# EAGLE design NodeBoard (EAGLE 8.4.0)
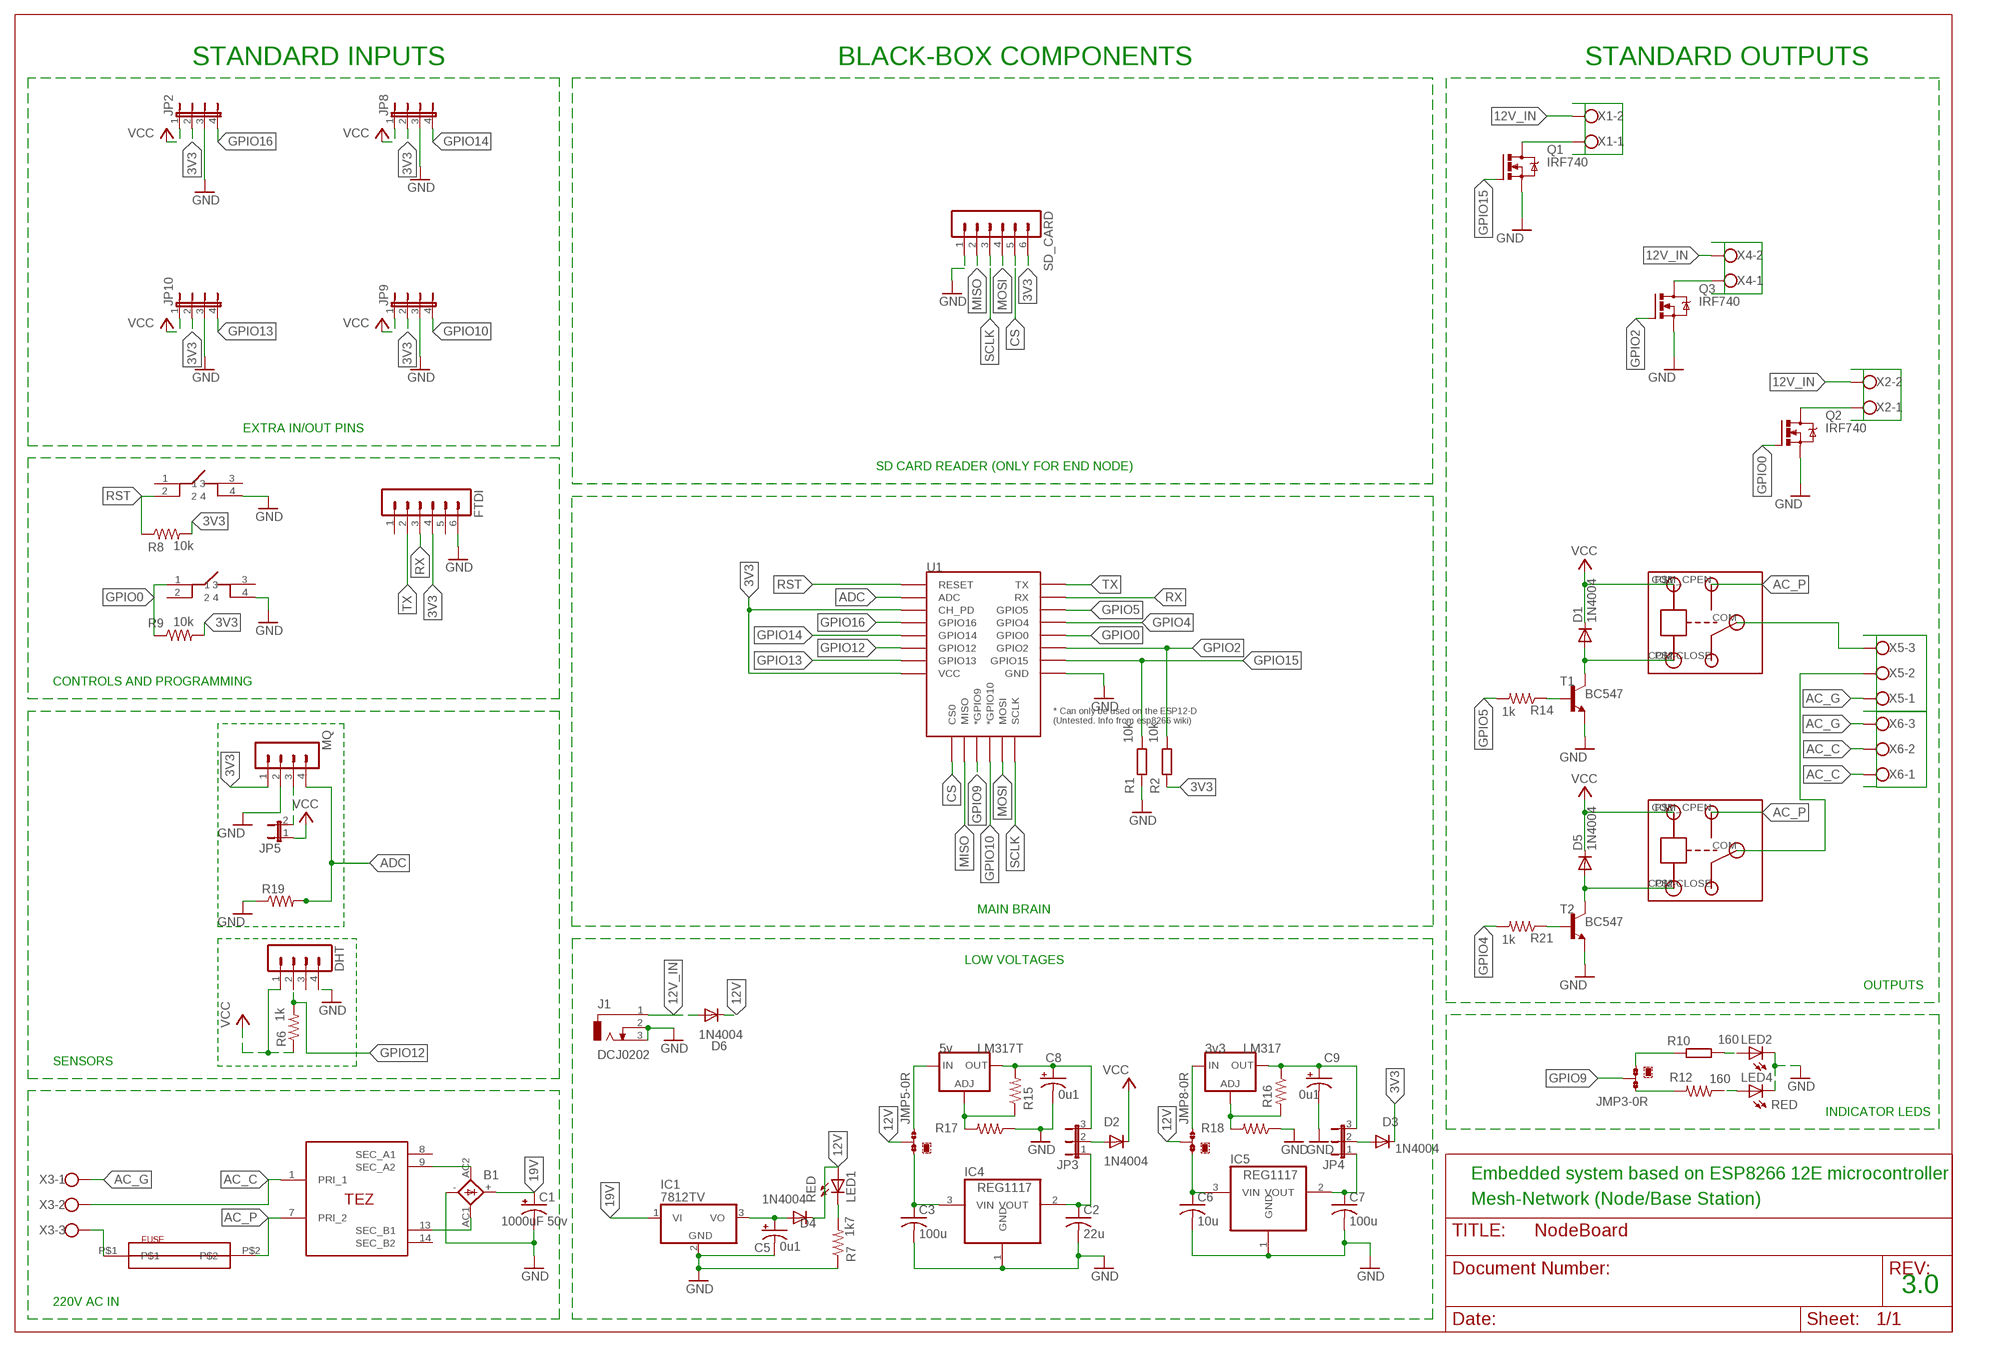
[diagram p0: schematic, sheet 1]

## Parts
B1  KBL  [KBL]
C1  1000uF 50v  CPOL-USE5-13  [E5-13]
C2  22u  C-USC0805  [C0805]
C3  100u  C-USC0805  [C0805]
C5  0u1  CPOL-USE2,5-6E  [E2,5-6E]
C6  10u  C-USC0805  [C0805]
C7  100u  C-USC0805  [C0805]
C8  0u1  CPOL-USE2,5-6E  [E2,5-6E]
C9  0u1  CPOL-USE2,5-6E  [E2,5-6E]
D1  1N4004  [DO41-10]
D2  1N4004  [DO41-10]
D3  1N4004  [DO41-10]
D4  1N4004  [DO41-10]
D5  1N4004  [DO41-10]
D6  1N4004  [DO41-10]
DHT  MA04-1  [MA04-1]
FTDI  MA06-1  [MA06-1]
IC1  7812TV  [TO220V]
IC4  REG1117  [SOT223]
IC5  REG1117  [SOT223]
J1  DCJ0202  [DCJ0202]
JMP3  0R-JUMPA  [A0R-JMP]
JMP5  0R-JUMPA  [A0R-JMP]
JMP8  0R-JUMPA  [A0R-JMP]
JP2  JP4E  [JP4]
JP3  JP2E  [JP2]
JP4  JP2E  [JP2]
JP5  JP1E  [JP1]
JP8  JP4E  [JP4]
JP9  JP4E  [JP4]
JP10  JP4E  [JP4]
LED1  RED  LED5MM  [LED5MM]
LED2  LEDCHIPLED_1206  [CHIPLED_1206]
LED4  RED  LED5MM  [LED5MM]
LM317  3v3  LM317TS  [317TS]
LM317T  5v  LM317TS  [317TS]
MQ  MA04-1  [MA04-1]
Q1  IRF740  [TO220BV]
Q2  IRF740  [TO220BV]
Q3  IRF740  [TO220BV]
R1  10k  R-EU_R0603  [R0603]
R2  10k  R-EU_R0603  [R0603]
R6  1k  R-US_0204/7  [0204/7]
R7  1k7  R-US_0204/7  [0204/7]
R8  10k  R-US_0204/7  [0204/7]
R9  10k  R-US_0204/7  [0204/7]
R10  160  R-EU_R0603  [R0603]
R12  160  R-US_0204/7  [0204/7]
R14  1k  R-US_0204/7  [0204/7]
R15  15k  R-US_0204/7  [0204/7]
R16  1k7  R-US_0204/7  [0204/7]
R17  28k  R-US_0204/7  [0204/7]
R18  1k7  R-US_0204/7  [0204/7]
R19  R-US_0204/7  [0204/7]
R21  1k  R-US_0204/7  [0204/7]
SD_CARD  MA06-1  [MA06-1]
T1  BC547  [TO92]
T2  BC547  [TO92]
U1  ESP12ESMD  [ESP12E-SMD]
U$1  RELAY  [RELAY]
U$2  TEZ_16THROUGH_HOLE  [TEZ_16]
U$3  FUSE_24X11THROUGH_HOLE  [FUSE_24X11]
U$4  RELAY  [RELAY]
U$5  TACT_SWITCHTHROUGH_HOLE  [TACT_SWITCH_TH]
U$6  TACT_SWITCHTHROUGH_HOLE  [TACT_SWITCH_TH]
X1  W237-102  [W237-102]
X2  W237-102  [W237-102]
X3  W237-103  [W237-103]
X4  W237-102  [W237-102]
X5  W237-103  [W237-103]
X6  W237-103  [W237-103]

## Nets
3V3 [3v3]: D3.C FTDI.4 JP2.2 JP8.2 JP9.2 JP10.2 MQ.1 R2.1 R8.2 R9.2 SD_CARD.6 U1.CH_PD U1.VCC
12V [12v]: D4.C D6.C JMP5.2 JMP8.2 LED1.A
12V_IN [12v]: D6.A J1.1 X1.2 X2.2 X4.2
19V [19v]: B1.+ C1.+ IC1.1(VI)
AC_C [220v]: U$2.1(PRI_1) X3.2 X6.1 X6.2
AC_G [220v]: X3.1 X5.1 X6.3
AC_P [220v]: U$1.COM_CPEN(COM-OPEN) U$2.7(PRI_2) U$3.P$2 U$4.COM_CPEN(COM-OPEN)
ADC: MQ.4 R19.2 U1.ADC
CS: SD_CARD.5 U1.CS0
GND: B1.- C1.- C2.2 C3.2 C5.- C6.2 C7.2 C8.- C9.- DHT.4 FTDI.6 IC1.2(GND) IC4.1(GND) IC5.1(GND) J1.2 J1.3 JP2.3 JP8.3 JP9.3 JP10.3 LED2.C LED4.K(C) MQ.2 Q1.S Q2.S Q3.S R1.1 R7.1 R17.1 R18.1 R19.1 SD_CARD.1 T1.1(E) T2.1(E) U1.GND U$5.4 U$6.4
GPIO0: Q2.G R9.1 U1.GPIO0 U$6.1
GPIO2: Q3.G R2.2 U1.GPIO2
GPIO4: R21.2 U1.GPIO4
GPIO5: R14.2 U1.GPIO5
GPIO9: JMP3.2 U1.GPIO9(*GPIO9)
GPIO10: JP9.4 U1.GPIO10(*GPIO10)
GPIO12: DHT.2 R6.2 U1.GPIO12
GPIO13: JP10.4 U1.GPIO13
GPIO14: JP8.4 U1.GPIO14
GPIO15: Q1.G R1.2 U1.GPIO15
GPIO16: JP2.4 U1.GPIO16
MISO: SD_CARD.2 U1.MISO
MOSI: SD_CARD.4 U1.MOSI
N$2 [19v]: B1.AC2(AC1) U$2.9(SEC_A2)
N$4: LED1.K(C) R7.2
N$5 [19v]: B1.AC1(AC2) U$2.13(SEC_B1)
N$8 [220v]: U$1.COM X5.3
N$9: JP5.2 MQ.3
N$18: Q1.D X1.1
N$22: Q3.D X4.1
N$31: LED2.A R10.2
N$33: LED4.A R12.1
N$36: JMP3.1 R12.2
N$37: JMP3.3 R10.1
N$41: R14.1 T1.2(B)
N$42: D1.A T1.3(C) U$1.P$2(GND)
N$44: R21.1 T2.2(B)
N$45 [5v]: C8.+ JP3.3 LM317T.2(OUT) R15.2
N$46: LM317T.1(ADJ) R15.1 R17.2
N$47 [3v3]: C9.+ JP4.3 LM317.2(OUT) R16.1
N$48: LM317.1(ADJ) R16.2 R18.2
N$49 [12v]: JMP5.3 LM317T.3(IN)
N$50 [12v]: JMP8.3 LM317.3(IN)
N$51 [5v]: D2.A JP3.2
N$52 [3v3]: D3.A JP4.2
N$53 [12v]: C5.+ D4.A IC1.3(VO)
N$54 [5v]: C2.1 IC4.2(VOUT) JP3.1
N$55 [12v]: C6.1 IC5.3(VIN) JMP8.1
N$56 [12v]: C3.1 IC4.3(VIN) JMP5.1
N$57: Q2.D X2.1
N$58 [3v3]: C7.1 IC5.2(VOUT) JP4.1
N$60: D5.A T2.3(C) U$4.P$2(GND)
N$62 [220v]: U$3.P$1 X3.3
N$63 [220v]: U$4.COM X5.2
RST: R8.1 U1.RESET U$5.2
RX: FTDI.3 U1.RXD0(RX)
SCLK: SD_CARD.3 U1.SCLK
TX: FTDI.2 U1.TXD0(TX)
VCC [5v]: D1.C D2.C D5.C DHT.1 JP2.1 JP5.1 JP8.1 JP9.1 JP10.1 R6.1 U$1.P$1(IN) U$4.P$1(IN)
Unconnected: DHT.3 FTDI.1 FTDI.5 U$1.COM-CLOSE U$2.8(SEC_A1) U$2.14(SEC_B2) U$4.COM-CLOSE U$5.1 U$5.3 U$6.2 U$6.3

## Notes on the sheet
- STANDARD INPUTS | BLACK-BOX COMPONENTS | STANDARD OUTPUTS
- EXTRA IN/OUT PINS
- SD CARD READER (ONLY FOR END NODE)
- CONTROLS AND PROGRAMMING
- MAIN BRAIN
- LOW VOLTAGES
- OUTPUTS
- SENSORS
- INDICATOR LEDS
- Embedded system based on ESP8266 12E microcontroller
- Mesh-Network (Node/Base Station)
- 3.0
- 220V AC IN

## Library data of the parts
B1 = rectifier:KBL: DIOTEC RECTIFIER
C1 = adafruit:CPOL-US: POLARIZED CAPACITOR, American symbol
C2 C3 C6 C7 = adafruit:C-US: CAPACITOR, American symbol
C5 C8 C9 = resistor:CPOL-US: POLARIZED CAPACITOR, American symbol
D1-D6 = adafruit:1N4004: DIODE General purpose 1N400x type rectifier (With bigger pads) http://www.ladyada.net/library/pcb/eaglelibrary.html
DHT MQ = con-lstb:MA04-1: PIN HEADER; OC_FARNELL: unknown; OC_NEWARK: unknown
FTDI SD_CARD = con-lstb:MA06-1: PIN HEADER; OC_FARNELL: unknown; OC_NEWARK: unknown
IC1 = linear:78*: Positive VOLTAGE REGULATOR Source: http://cache.national.com/ds/LM/LM78L05.pdf http://www.fairchildsemi.com/ds/LM/LM7805.pdf
IC4 IC5 = burr-brown:REG1117: 800mA and 1A Low Dropout (LDO) Positive Regulator 1.8V, 2.5V, 2.85V, 3.3V, 5V, and Adj; MPN: REG1117; OC_FARNELL: 1097566; OC_NEWARK: 14P6981
J1 = con-jack:DCJ0202: DC POWER JACK Source: DCJ0202.pdf; OC_FARNELL: unknown; OC_NEWARK: unknown
JMP3 JMP5 JMP8 = jump-0r-smd:0R-JUMP: SMD 0R 0805 Jumper
JP2 JP8-JP10 = jumper:JP4E: JUMPER
JP3 JP4 = jumper:JP2E: JUMPER
JP5 = jumper:JP1E: JUMPER
LED1 LED4 = led:LED: LED
LED2 = adafruit:LED: LED
LM317 LM317T = v-reg:LM317TS: VOLTAGE REGULATOR
Q1-Q3 = transistor-power:IRF740: N-CHANNEL MOS FET
R1 R2 R10 = resistor:R-EU_: RESISTOR, European symbol
R6-R9 R12 R14-R19 R21 = rcl:R-US_: RESISTOR, American symbol
T1 T2 = transistor:BC547: NPN TRANSISTOR
U1 = esp8266modules:ESP12E: ESP12E Module
U$1 U$4 = relay:RELAY
U$2 = tez_16_transformer:TEZ_16
U$3 = fuse_24x11:FUSE_24X11
U$5 U$6 = tact_switch_th:TACT_SWITCH
X1 X2 X4 = con-wago-500:W237-102: WAGO SCREW CLAMP; MPN: 237-102; OC_FARNELL: unknown; OC_NEWARK: 70K9898
X3 X5 X6 = con-wago-500:W237-103: WAGO SCREW CLAMP; MPN: 237-103; OC_FARNELL: unknown; OC_NEWARK: 18M7116

## Net classes
0 default: width 0.5 mm, clearance 0.45 mm
1 220v: width 2.2 mm, clearance 2.8 mm
2 12v: width 0.5 mm, clearance 0.45 mm
3 5v: width 0.5 mm, clearance 0.45 mm
4 3v3: width 0.5 mm, clearance 0.45 mm
5 19v: width 1 mm, clearance 0.45 mm

## Board
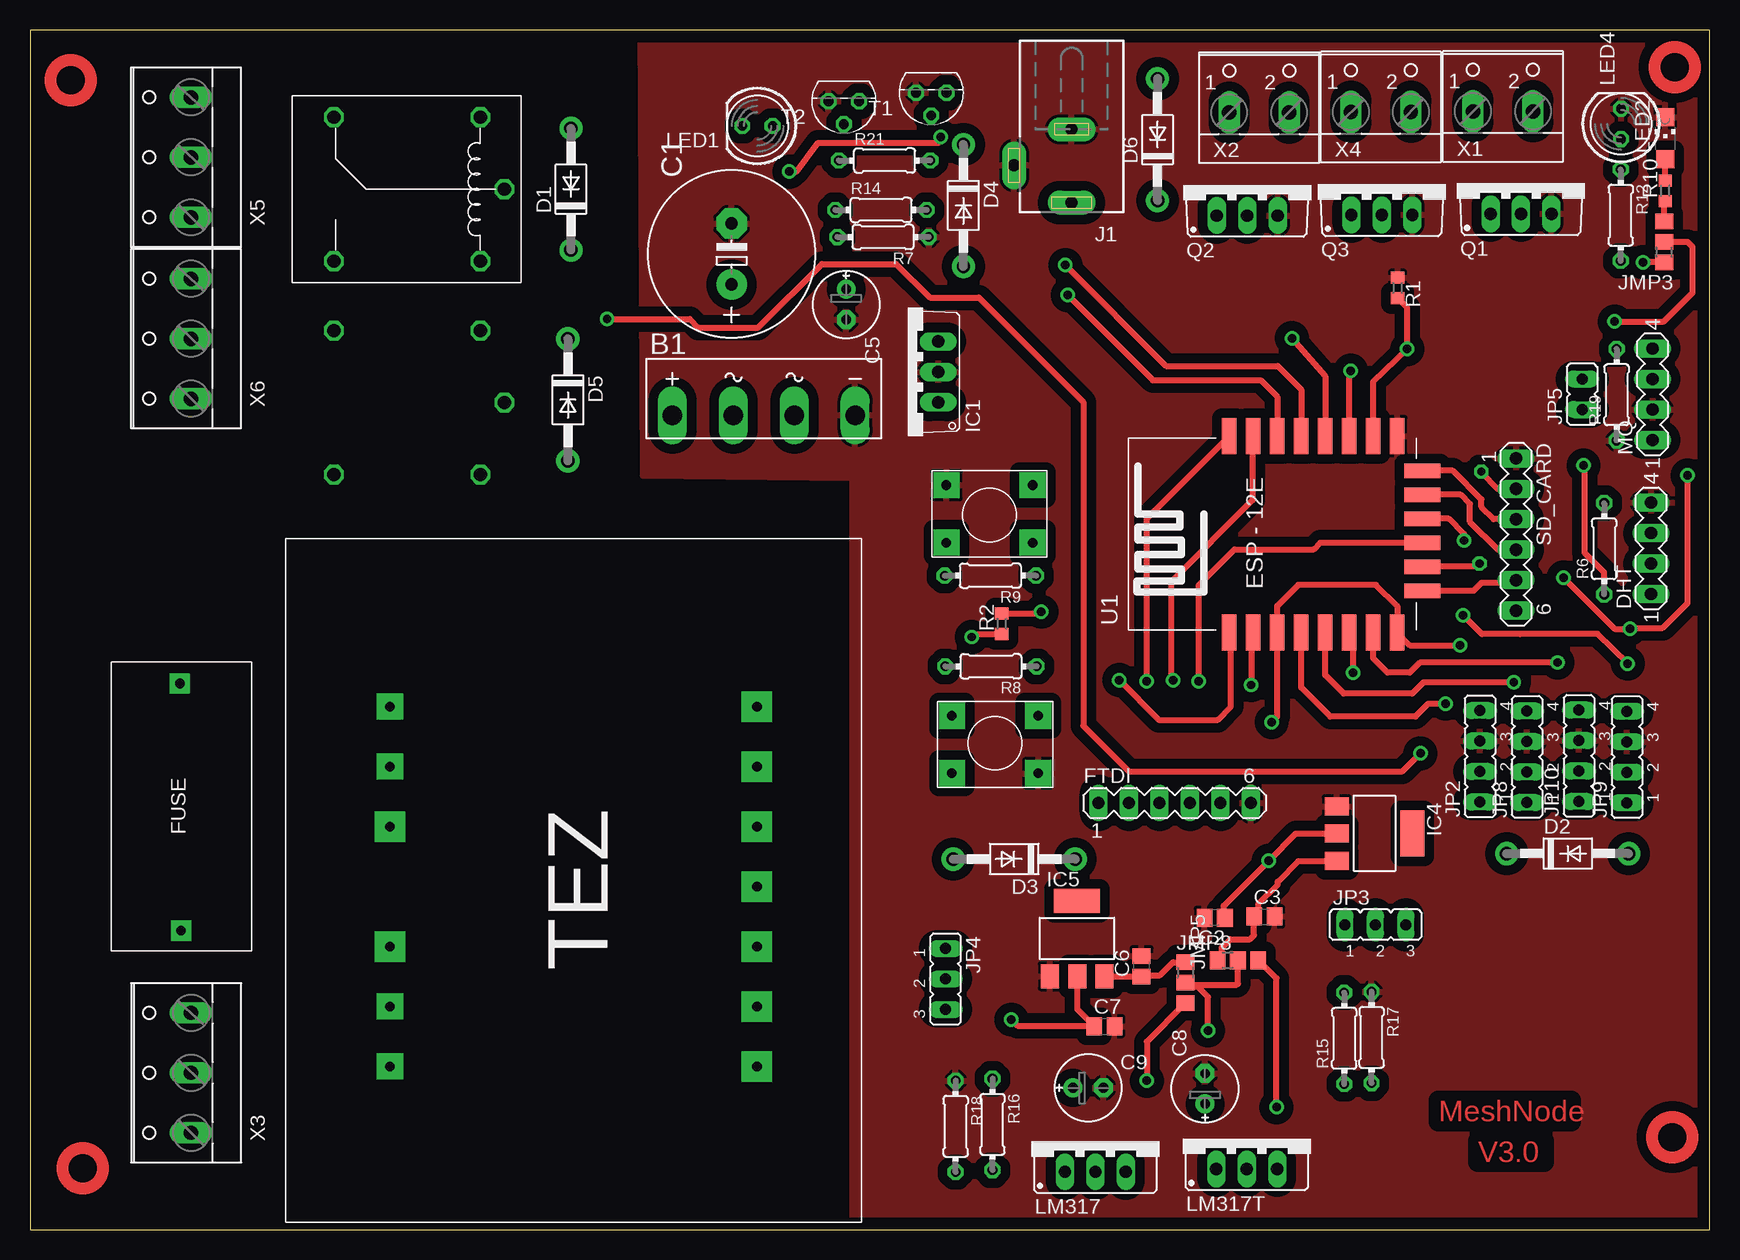
[diagram p1: board, top side]
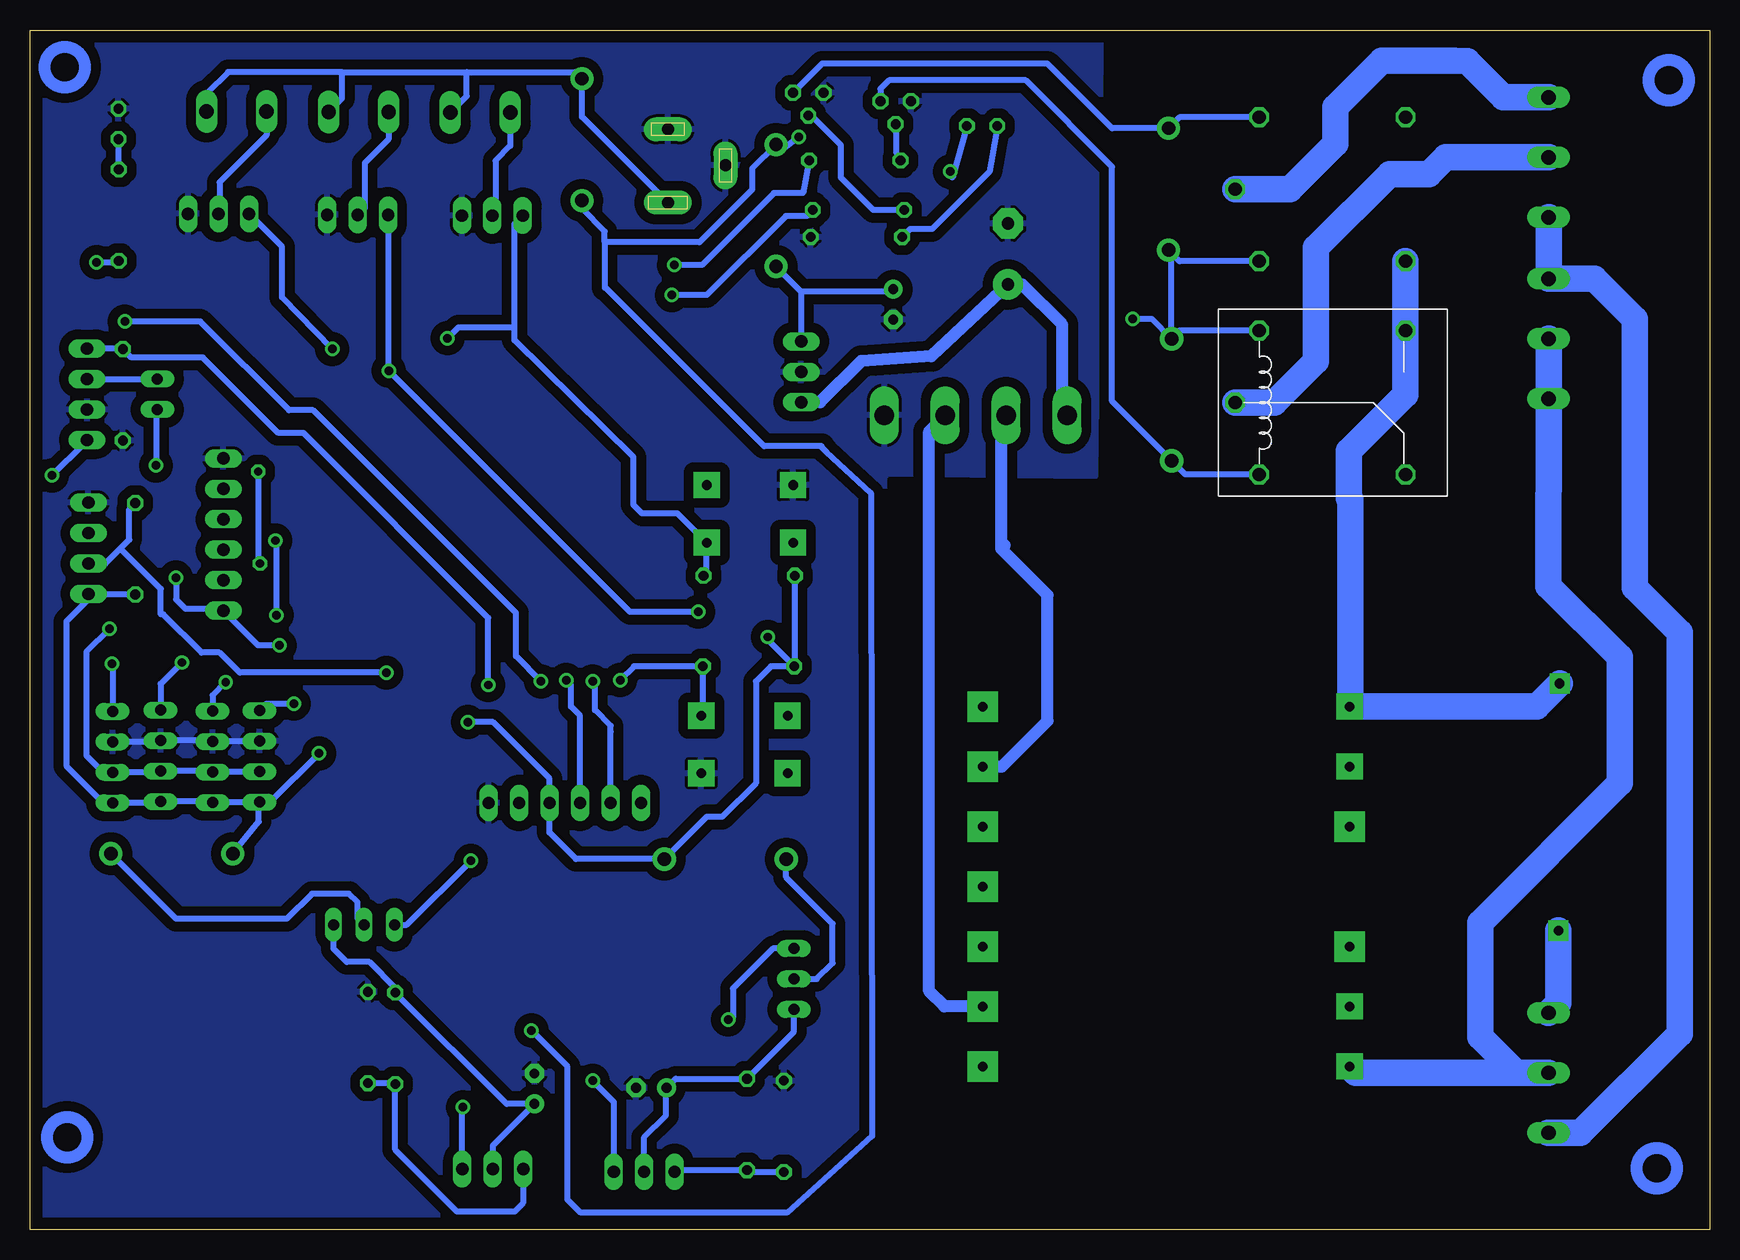
[diagram p2: board, bottom side, seen from below]

Size 140 x 100 mm. Coordinates in mm from the lower left corner, seen from the top.
Outline: 0,0 140,0 140,100 0,100 0,0
Copper layers (1*16): Top 0.035mm / dielectric 1.5mm / Bottom 0.035mm
Design rules "default": minimum track width 6mil, minimum drill 0.35mm, track to track 6mil, track to pad 6mil, pad to pad 6mil, via to via 6mil, smd to smd 6mil, copper to edge 40mil, drill to drill 6mil, minimum pad ring 10mil, minimum via ring 8mil, stop-mask expansion 4mil, vias tented up to drill 0mil, thermal gap 10mil

### Footprints (pad centres in the part's own frame; a part is rotated, then mirrored left to right if it is on the bottom)
KBL = drill 1.6 long: + -7.62,-1.27; - 7.62,-1.27; AC1 2.54,-1.27; AC2 -2.54,-1.27
E5-13 = drill 1.016 pad 2.54: + -2.54,0 | drill 1.016 pad 2.54 octagon: - 2.54,0
C0805 = smd 1.3 x 1.5: 1 -0.85,0; 2 0.85,0
E2,5-6E = drill 0.813 pad 1.575: + -1.27,0 | drill 0.813 pad 1.575 octagon: - 1.27,0
DO41-10 = drill 1.118 pad 1.93: A 5.08,0; C -5.08,0
MA04-1 = drill 1.016 long: 1 -3.81,0; 2 -1.27,0; 3 1.27,0; 4 3.81,0
MA06-1 = drill 1.016 long: 1 -6.35,0; 2 -3.81,0; 3 -1.27,0; 4 1.27,0; 5 3.81,0; 6 6.35,0
TO220V = drill 1.016 long: 1 -2.54,-2.54; 2 0,-2.54; 3 2.54,-2.54
SOT223 = smd 1.499 x 2.007: 1 -2.261,-3.15; 2 0.025,-3.15; 3 2.311,-3.15 | smd 3.81 x 2.007: 4 0,3.15
DCJ0202 = drill 1 pad 2 long: 1 0,3.1; 2 4.8,0; 3 0,-3
A0R-JMP = smd 1.5 x 1.3: 1 0,1.7; 2 0,0; 3 0,-1.7
JP4 = drill 0.914 long: 1 -3.81,0; 2 -1.27,0; 3 1.27,0; 4 3.81,0
JP2 = drill 0.914 long: 1 -2.54,0; 2 0,0; 3 2.54,0
JP1 = drill 0.914 long: 1 0,-1.27; 2 0,1.27
LED5MM = drill 0.813 octagon: A -1.27,0; K 1.27,0
CHIPLED_1206 = smd 1.5 x 1.5: A 0,-1.75; C 0,1.75
317TS = drill 1.016 long: 1 -2.54,-2.54; 2 0,-2.54; 3 2.54,-2.54
TO220BV = drill 1.016 long: D 0,-2.54; G -2.54,-2.54; S 2.54,-2.54
R0603 = smd 1 x 1.1: 1 -0.85,0; 2 0.85,0
0204/7 = drill 0.813 octagon: 1 -3.81,0; 2 3.81,0
TO92 = drill 0.813 octagon: 1 1.27,0; 2 0,1.905; 3 -1.27,0
ESP12E-SMD = smd 3 x 1.2: ADC -8.3,3.8; CH_PD -8.3,1.8; GND 8.1,-8.2; GPIO0 8.1,-2.2; GPIO2 8.1,-4.2; GPIO4 8.1,-0.2; GPIO5 8.1,1.8; GPIO12 -8.3,-4.2; GPIO13 -8.3,-6.2; GPIO14 -8.3,-2.2; GPIO15 8.1,-6.2; GPIO16 -8.3,-0.2; RESET -8.3,5.8; RXD0 8.1,3.8; TXD0 8.1,5.8; VCC -8.3,-8.2 | smd 1.2 x 3: CS0 -4.8,-10.3; GPIO9 -0.8,-10.3; GPIO10 1.2,-10.3; MISO -2.8,-10.3; MOSI 3.2,-10.3; SCLK 5.2,-10.3
RELAY = drill 1.1 octagon: COM -2,0; COM-CLOSE 12.2,-6; COM_CPEN 12.2,6; P$1 0,6; P$2 0,-6
TEZ_16 = drill 0.8 pad 2.184 square: 1 -14.7,17.7; 2 -9.7,17.7; 6 10.3,17.7; 7 15.3,17.7 | drill 0.8 pad 2.54 square: 3 -4.7,17.7; 5 5.3,17.7; 8 15.3,-12.9; 9 10.3,-12.9; 10 5.3,-12.9; 11 0.3,-12.9; 12 -4.7,-12.9; 13 -9.7,-12.9; 14 -14.7,-12.9
FUSE_24X11 = drill 0.8 pad 1.676 square: P$1 -9.73,0.82; P$2 10.87,0.92
TACT_SWITCH_TH = drill 0.8 pad 2.184 square: 1 -3.4,2.59; 2 3.8,2.59; 3 -3.4,-2.21; 4 3.8,-2.21
W237-102 = drill 1.194 long: 1 -2.5,-1.27; 2 2.5,-1.27
W237-103 = drill 1.194 long: 1 -5,-1.29; 2 0,-1.29; 3 5,-1.29

### Placement (x,y rotation side)
B1  61.17,69.15 0 top
C1  58.48,81.33 90 top
C2  98.75,26 180 top
C3  102.89,26.09 0 top
C5  68.04,77.12 270 top
C6  92.66,21.95 90 top
C7  89.56,16.95 0 top
C8  97.95,11.74 90 top
C9  88.21,11.81 0 top
D1  45.1,86.73 90 top
D2  128.18,31.34 0 top
D3  82.04,30.88 180 top
D4  77.81,85.37 270 top
D5  44.84,69.17 270 top
D6  93.99,90.86 90 top
DHT  135.13,56.79 90 top
FTDI  95.42,35.56 0 top
IC1  73.17,71.5 90 top
IC4  112.08,33.03 270 top
IC5  87.27,24.26 0 top
J1  86.83,88.71 180 top
JMP3  136.23,82.33 180 top
JMP5  100.69,22.45 90 top
JMP8  96.32,20.58 0 top
JP2  120.87,39.45 90 top
JP3  112.16,25.4 0 top
JP4  76.32,20.88 270 top
JP5  129.38,69.63 0 top
JP8  124.79,39.4 90 top
JP9  133.12,39.39 90 top
JP10  129.11,39.49 90 top
LED1  60.64,92 180 top
LED2  136.3,90.96 0 top
LED4  132.63,92.17 90 top
LM317  88.8,7.35 0 top
LM317T  101.42,7.58 0 top
MQ  135.25,69.63 90 top
Q1  124.29,87.21 0 top
Q2  101.46,87.07 0 top
Q3  112.69,87.13 0 top
R1  114,78.5 270 top
R2  81,50.5 90 top
R6  131.22,56.75 90 top
R7  71.11,82.74 180 top
R8  80.1,46.95 180 top
R9  80.05,54.51 180 top
R10  136.3,86.6 90 top
R12  132.6,84.56 270 top
R14  70.94,85 0 top
R15  109.55,15.94 90 top
R16  80.23,8.76 270 top
R17  111.83,16.01 270 top
R18  77.16,8.6 270 top
R19  132.26,69.59 90 top
R21  71.24,89.12 0 top
SD_CARD  123.88,57.94 270 top
T1  75.13,94.77 180 top
T2  67.84,94.06 180 top
U1  105.77,58.06 90 top
U$1  37.54,86.72 180 top
U$2  47.7,28.3 90 top
U$3  13.41,34.65 90 top
U$4  37.54,68.94 0 bottom
U$5  80.25,40.25 0 top
U$6  80.19,59.85 180 top
X1  122.78,94.49 0 top
X2  102.46,94.39 0 top
X3  12.14,13.06 90 top
X4  112.61,94.44 0 top
X5  12.12,89.38 90 top
X6  12.12,74.26 90 top

### Tracks (layer width: path | path; a pad name or v marks a point on that pad's centre or on a via)
3V3  (via drill 0.7 pad 1.2)
  Top 0.5: v127.83,54.34 132.09,50.08 v133.37,50.08 133.44,50.15 136.1,50.15 138.17,52.22 v138.17,62.87 | v103.5,42.3 103.97,42.77 U1.CH_PD 103.97,52 105.72,53.75 112.2,53.75 113.97,51.98 U1.VCC 115.03,48.7 v119.2,48.7 | v78.5,49.4 78.75,49.65 R2.1
  Bottom 0.5: MQ.1 135.5,65.57 135.5,65.54 v138.17,62.87 | v133.37,50.08 135.28,48.17 135.28,39.49 133.91,38.12 JP9.2 129.21,38.12 JP10.2 124.88,38.22 JP8.2 120.92,38.13 JP2.2 | v127.83,54.34 127.83,52.53 127.06,51.76 124.05,51.76 SD_CARD.6 120.99,48.7 v119.2,48.7 | v103.5,42.3 101.4,42.3 96.69,37.59 FTDI.4 96.69,33.09 94.48,30.88 D3.C 83.6,34.4 82.3,34.4 79.5,37.2 79.5,45.7 78.25,46.95 R8.2 | R8.2 76.29,54.46 R9.2 | R8.2 78.5,49.16 v78.5,49.4
12V  (via drill 0.7 pad 1.2)
  Top 0.5: JMP8.2 96.5,20.4 96.8,20.4 | 96.8,20.4 100.6,20.4 100.69,20.49 JMP5.2 | 96.8,20.4 96.97,20.23 97.36,20.23 98.2,19.39 v98.2,16.6 | v63.3,88.2 63.9,88.2 65.7,90.6 75.7,90.6 75.7,90.9 v75.9,91.1
  Bottom 0.5: D6.C 93.99,85.09 92.1,83.2 92.1,82.3 | LED1.A 63.11,87.7 v63.3,88.2 | 92.1,82.3 92.1,78.6 | 92.1,78.6 92.1,78.5 | v98.2,16.6 95.2,13.6 95.2,2.5 94.1,1.4 76.9,1.4 69.8,7.8 69.9,61.4 73.6,64.8 74,65.2 74,65.3 78.8,65.3 92.1,78.6 | v75.9,91.1 77.36,90 D4.C 79.8,88.46 79.8,86.7 84.2,82.3 92.1,82.3
12V_IN
  Bottom 0.5: J1.1 93.99,92.77 D6.A 94.55,96.5 103.6,96.5 | 114,96.5 103.6,96.5 | 114,96.5 123.5,96.5 125.28,94.72 X1.2 | X2.2 103.6,94.48 103.6,96.5 | X4.2 114,94.28 114,96.5
19V
  Bottom 1: B1.+ 53.94,68.27 53.94,75.42 57.31,78.79 C1.+ 64.87,72.8 70.7,72.4 74.14,68.96 IC1.1
AC_C
  Bottom 2.2: 16.11,13.06 29.46,13.06 U$2.1 | X6.2 X6.1 13.43,53.65 7.49,47.71 7.49,37.21 19.12,25.58 19.12,16.07 16.11,13.06 | 16.11,13.06 X3.2
AC_G
  Bottom 2.2: X5.1 X6.3 9.6,79.26 6.23,75.89 6.23,53.52 2.49,49.78 2.49,16.32 10.75,8.06 X3.1
AC_P
  Bottom 2.2: U$1.COM_CPEN U$4.COM_CPEN 25.34,69.62 30.07,64.9 30.07,60.98 29.92,60.84 29.92,43.68 U$2.7 14.41,43.6 U$3.P$2
ADC  (via drill 0.7 pad 1.2)
  Top 0.5: U1.ADC 101.8,49.59 v101.8,45.4
  Bottom 0.5: MQ.4 132.3,73.44 R19.2 131.56,72.7 125.6,72.7 119.3,66.4 117.2,66.4 101.8,51 v101.8,45.4
CS
  Top 0.5: U1.CS0 120.34,53.26 121,53.92 123.67,53.92 SD_CARD.5
GND
  Bottom 0.5: JP2.3 120.92,40.67 JP8.3 124.88,40.76 JP10.3 129.21,40.66 JP9.3
  pour Bottom (isolate 0.813): 50.71,100.97 51.21,62.78 68.55,62.98 68.83,62.7 68.83,-0.27 68.73,-0.37 140.19,-0.37 141.02,0.46 139.82,99.75 140.03,100.14 50.91,101.14 50.85,101.18 50.66,101.08
  pour Top (isolate 0.813): 50.87,100.84 51.07,62.85 68.43,62.65 68.5,62.72 68.5,-0.08 69.12,-0.7 139.64,-0.7 141.22,0.88 140.22,100.82 140.07,100.27
GPIO0  (via drill 0.7 pad 1.2)
  Top 0.5: v105.2,74.3 107.97,71.13 U1.GPIO0
  Bottom 0.5: R9.1 83.59,54.78 U$6.1 86.03,59.7 89,59.7 89.7,60.4 89.7,64.41 99.62,74.13 99.62,75.2 | 99.62,75.2 99.62,83.83 Q2.G | 99.62,75.2 104.3,75.2 v105.2,74.3
GPIO2  (via drill 0.7 pad 1.2)
  Top 0.5: U1.GPIO2 109.97,71.47 v110.1,71.6 | R2.2 84.15,51.35 v84.3,51.5
  Bottom 0.5: Q3.G 110.1,84.54 v110.1,71.6 90,51.5 v84.3,51.5
GPIO4  (via drill 0.7 pad 1.2)
  Top 0.5: v86.3,80.4 94.7,72 104,72 105.97,70.03 U1.GPIO4
  Bottom 0.5: R21.2 75.57,86.4 78,86.4 84,80.4 v86.3,80.4
GPIO5  (via drill 0.7 pad 1.2)
  Top 0.5: v86.5,77.9 93.6,70.8 102.6,70.8 103.97,69.43 U1.GPIO5
  Bottom 0.5: R14.2 75.25,84.5 77,84.5 83.6,77.9 v86.5,77.9
GPIO9  (via drill 0.7 pad 1.2)
  Top 0.5: v97.4,45.7 97.4,53.7 100.4,56.7 107,56.7 107.56,57.26 U1.GPIO9 | v132.1,75.7 136.2,75.7 138.6,78.1 138.6,81.9 138.17,82.33 JMP3.2
  Bottom 0.5: v97.4,45.7 99.5,47.8 99.5,51.4 116.4,68.3 118.4,68.3 125.8,75.7 v132.1,75.7
GPIO10  (via drill 0.7 pad 1.2)
  Top 0.5: v133.18,47.18 130.66,49.65 124.22,49.64 121.03,49.64 v119.45,51.22 | v119.54,57.44 119.54,57.99 118.27,59.26 U1.GPIO10
  Bottom 0.5: v119.45,51.22 119.45,57.35 v119.54,57.44 | v133.18,47.18 133.12,47.12 JP9.4
GPIO12  (via drill 0.7 pad 1.2)
  Top 0.5: U1.GPIO12 110.29,49.44 v110.29,46.42
  Bottom 0.5: DHT.2 133.71,55.52 132.46,56.77 | 132.46,56.77 131.72,57.51 131.72,60.06 R6.2 | 132.46,56.77 129.09,53.4 129.09,51.29 128.89,51.29 125.7,48.1 124.2,48.1 122.52,46.42 v110.29,46.42
GPIO13  (via drill 0.7 pad 1.2)
  Top 0.5: v127.33,47.27 115.86,47.27 115.01,46.42 113.16,46.42 111.97,47.61 U1.GPIO13
  Bottom 0.5: v127.33,47.27 129.11,45.49 JP10.4
GPIO14  (via drill 0.7 pad 1.2)
  Top 0.5: v123.69,45.63 116.17,45.63 115.22,44.68 109.5,44.68 107.97,46.21 U1.GPIO14
  Bottom 0.5: v123.69,45.63 124.79,44.53 JP8.4
GPIO15  (via drill 0.7 pad 1.2)
  Top 0.5: U1.GPIO15 111.97,70.67 v114.8,73.4 114.8,76.85 R1.2
  Bottom 0.5: Q1.G 119,81.92 119,77.7 v114.8,73.4
GPIO16  (via drill 0.7 pad 1.2)
  Top 0.5: v118,43.83 116.54,43.83 115.48,42.77 108.38,42.77 105.97,45.18 U1.GPIO16
  Bottom 0.5: v118,43.83 120.3,43.83 JP2.4
MISO  (via drill 0.7 pad 1.2)
  Top 0.5: SD_CARD.2 122.33,61.75 120.98,63.1 v120.98,63.19 | v120.82,55.52 120.56,55.26 U1.MISO
  Bottom 0.5: v120.98,63.19 120.98,55.68 v120.82,55.52
MOSI
  Top 0.5: SD_CARD.4 122.37,56.67 120.04,59 120.04,60.48 119.26,61.26 U1.MOSI
N$2
  Bottom 1: U$2.9 58.99,38.6 55.18,42.41 55.18,52.89 59.04,56.75 | 59.04,56.75 58.73,57.06 | 59.04,56.75 59.04,67.47 B1.AC2
N$4
  Bottom 0.5: LED1.K 60.03,88.17 64.8,83.4 66.64,83.4 R7.2
N$5
  Bottom 1: U$2.13 63.78,18.6 65.05,19.87 65.05,66.54 64.09,67.5 | 64.09,67.5 64.95,66.64 | B1.AC1 64.09,67.5
N$8
  Bottom 2.2: U$1.COM 35,86.72 31.19,90.53 31.19,93.55 27.3,97.44 23.38,97.44 arc2 20.2,97.4 17.18,94.38 X5.3
N$9
  Bottom 0.5: MQ.3 JP5.2
N$18
  Bottom 0.5: X1.1 120.28,91.22 124.2,87.3 124.2,84.76 Q1.D
N$22
  Bottom 0.5: X4.1 110.11,90.89 112.1,88.9 112.1,85.18 Q3.D
N$31
  Top 0.5: R10.2 LED2.A
N$33
  Bottom 0.5: R12.1 132.6,90.87 LED4.A
N$36  (via drill 0.7 pad 1.2)
  Top 0.5: JMP3.1 v134.45,80.63
  Bottom 0.5: v134.45,80.63 132.72,80.63 R12.2
N$37
  Top 0.5: JMP3.3 136.23,85.68 R10.1
N$41
  Bottom 0.5: R14.1 69.7,85 72.4,87.7 72.4,90.4 74.86,92.86 T1.2
N$42
  Bottom 0.5: U$1.P$2 44.19,92.72 D1.A 49.81,91.81 55.2,97.2 73.97,97.2 T1.3
N$44
  Bottom 0.5: 67.79,92.15 67.43,92.14 | 67.79,92.15 T2.2 | R21.1 67.79,89.78 67.79,92.15
N$45
  Bottom 0.5: LM317T.2 101.42,7 C8.+ 100.27,10.47 R15.2 109.55,20.15 111.7,22.3 113.6,22.3 114.7,23.4 JP3.3
N$46
  Bottom 0.5: LM317T.1 98.9,5.02 98.9,2.2 99.6,1.5 104.4,1.5 109.55,6.65 R15.1 109.62,12.2 R17.2
N$47
  Bottom 0.5: LM317.2 88.8,7.7 87,9.5 87,11.75 C9.+ 86.18,12.57 R16.1 76.32,16.48 JP4.3
N$48
  Bottom 0.5: R18.2 80.07,4.79 R16.2 86.12,4.95 LM317.1
N$49  (via drill 0.7 pad 1.2)
  Top 0.5: v103.9,10.2 103.9,20.94 JMP5.3
  Bottom 0.5: LM317T.3 103.96,10.14 v103.9,10.2
N$50  (via drill 0.7 pad 1.2)
  Top 0.5: JMP8.3 93.1,15.66 v93.1,12.4
  Bottom 0.5: v93.1,12.4 91.34,10.64 LM317.3
N$51
  Bottom 0.5: 112.5,25.74 JP3.2 112.7,25.94 112.7,27.3 113.4,28 116.5,28 118.6,25.9 127.82,25.9 D2.A
N$52
  Bottom 0.5: JP4.2 74.42,20.88 73.1,22.2 73.1,25.5 76.96,29.36 D3.A
N$53
  Bottom 0.5: 75.71,78.19 D4.A | 75.71,78.19 IC1.3 | C5.+ 68.24,78.19 75.71,78.19
N$54  (via drill 0.7 pad 1.2)
  Top 0.5: C2.1 99.5,27 v103.25,30.75 105.5,33.01 IC4.2
  Bottom 0.5: JP3.1 108.6,25.4 v103.25,30.75
N$55
  Top 0.5: IC5.3 89.59,21.1 C6.1 92.76,21.2 94.2,21.2 95.28,22.28 JMP8.1
N$56
  Top 0.5: JMP5.1 99.34,22.8 99.34,23.49 100.05,24.2 101.7,24.2 102.04,24.54 C3.1 102.39,26.44 102.39,27.13 104,28.74 104,29 105.72,30.72 IC4.3
N$57
  Bottom 0.5: X2.1 99.96,90.34 101.2,89.1 101.2,84.79 Q2.D
N$58  (via drill 0.7 pad 1.2)
  Top 0.5: 88.68,16.98 C7.1 | 88.68,16.98 87.3,18.36 IC5.2 | v81.8,17.5 82.32,16.98 88.68,16.98
  Bottom 0.5: JP4.1 78.08,23.42 81.4,20.1 81.4,17.7 81.6,17.5 v81.8,17.5
N$60
  Bottom 0.5: U$4.P$2 43.69,62.94 D5.A | D5.A 45.39,64.09 | D5.A 49.8,69.05 49.8,88.6 57,95.8 68.4,95.8 69.11,95.09 T2.3
N$62
  Bottom 2.2: X3.3 12.59,18.9 U$3.P$1
N$63
  Bottom 2.2: U$4.COM 36.27,68.94 32.81,72.39 32.81,81.83 26.65,88 23.38,88 22,89.38 X5.2
RST  (via drill 0.7 pad 1.2)
  Top 0.5: v90.8,45.8 94.1,42.5 99,42.5 100.1,43.6 100.1,49.63 U1.RESET
  Bottom 0.5: U$5.2 83.91,42.98 R8.1 89.65,46.95 v90.8,45.8
RX  (via drill 0.7 pad 1.2)
  Top 0.5: U1.RXD0 101.9,66.09 101.9,60.8 95.1,54 95.1,46 v95.3,45.8
  Bottom 0.5: FTDI.3 94.15,42.85 94.9,43.6 94.9,45.4 v95.3,45.8
SCLK
  Top 0.5: SD_CARD.3 122.02,59.21 120.99,60.24 120.99,60.87 118.6,63.26 U1.SCLK
TX  (via drill 0.7 pad 1.2)
  Top 0.5: v93.1,45.7 93.1,59.29 U1.TXD0
  Bottom 0.5: FTDI.2 91.61,41.49 91.6,41.5 91.6,42 92.9,43.3 92.9,45.5 v93.1,45.7
VCC  (via drill 0.7 pad 1.2)
  Top 0.5: R6.1 131.22,54.78 129.6,56.4 129.6,63.6 v129.5,63.7 | v48.1,75.9 55,75.9 55.7,75.2 60.7,75.2 66,80.5 72.2,80.5 75,77.7 79.1,77.7 87.8,69 87.8,42 91.6,38.2 114.4,38.2 v115.9,39.7
  Bottom 0.5: U$4.P$1 44.15,74.94 D5.C | U$1.P$1 44.17,80.72 D1.C 44.84,81.39 D5.C | R6.1 131.26,52.98 DHT.1 135.13,52.53 136.96,50.7 136.96,38.66 133.88,35.58 JP9.1 129.21,35.58 JP10.1 124.88,35.68 JP8.1 120.92,35.59 | v129.5,63.7 129.5,68.24 JP5.1 | 120.92,35.59 JP2.1 119.96,35.64 v115.9,39.7 | D2.C 120.92,34.02 120.92,35.59 | D5.C 46.49,75.9 v48.1,75.9
(copper drawn outside any net)
  shapes: Bottom circle x4, Top circle x4

### Text on the board
Top: MeshNode | V3.0